# EasyEDA Pro project STM32控制板.eprj

# Schematic Schematic1
Create Date: 2023-07-01; Page Name: P1; Project Name: STM32控制板; Schematic Name: Schematic1; Update Date: 2023-07-01; Company: 嘉立创EDA; Page Size: A4; Version: V1.0
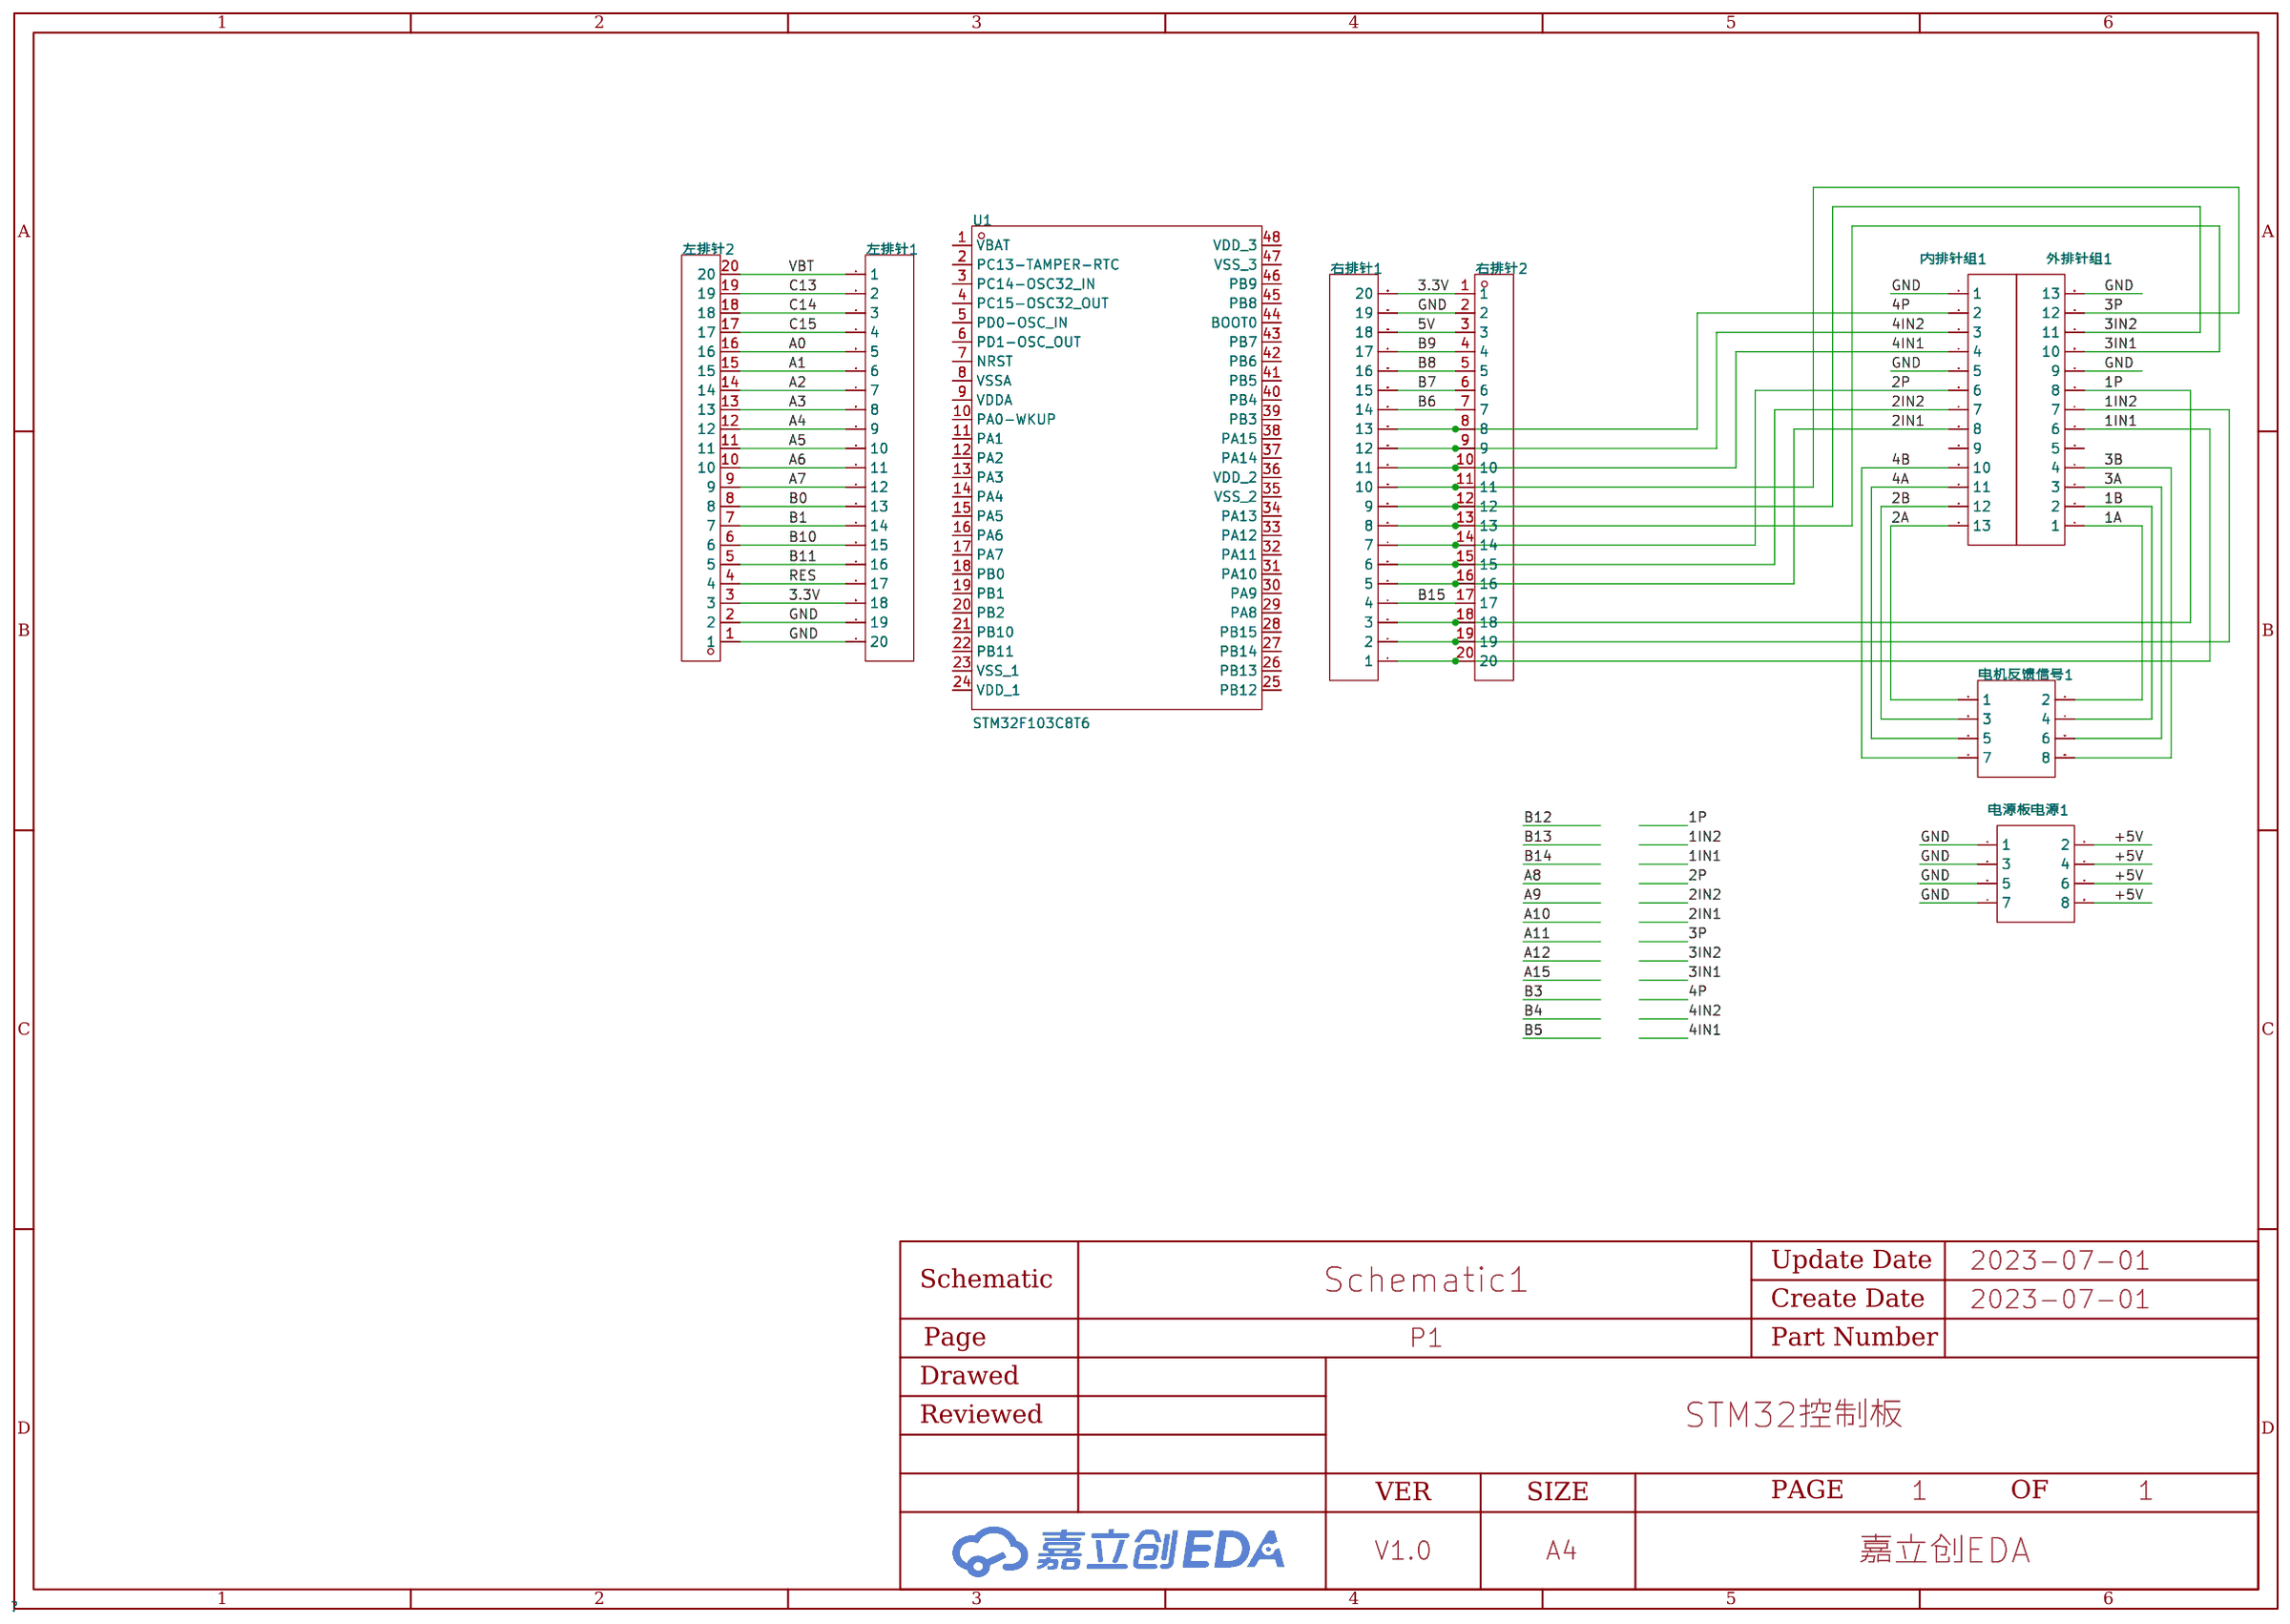
[diagram p0: schematic sheet]

## Parts
U1  STM32F103C8T6  [LQFP-48_L7.0-W7.0-P0.50-LS9.0-BL]
内排针组1  -  [HDR-TH_13P-P2.54-V-F]
右排针1  -  [HDR-TH_20P-P2.54-V-F]
右排针2  -  [HDR-TH_20P-P2.54-V-M-1]
外排针组1  -  [HDR-TH_13P-P2.54-V-F]
左排针1  -  [HDR-TH_20P-P2.54-V-F]
左排针2  -  [HDR-TH_20P-P2.54-V-M-1]
电机反馈信号1  -  [HDR-TH_8P-P2.54-V-F-R2-C4-S2.54-1]
电源板电源1  -  [HDR-TH_8P-P2.54-V-F-R2-C4-S2.54-1]

## Library data of the parts
U1 = STM32F103C8T6: CPU内核:ARM Cortex-M3;CPU最大主频:72MHz;程序存储容量:64KB;程序存储器类型:FLASH;RAM总容量:20KB;GPIO端口数量:37;; LCSC Part Name: ARM Cortex-M3 72MHz MSL=3; Supplier Part: C8734; Manufacturer: ST(意法半导体); Supplier Footprint: LQFP-48(7x7); JLCPCB Part Class: Basic Part; Datasheet: https://atta.szlcsc.com/upload/public/pdf/source/20220812/8363ACEC51AD55ECEB84799464F7CB85.pdf; Supplier: LCSC; CPU Core: ARM Cortex-M3; CPU Maximum Speed: 72MHz; Operating Voltage Range: 2V~3.6V; Program Storage Size: 64KB; Program Memory Type: FLASH; RAM Size: 20KB; GPIO Ports Number: 37; ADC (Bit): 12bit; Universal Serial Bus: 有; Peripheral/Function: 看门狗；DMA；看门狗；片载温度传感器; Watchdog: 有; Infrared Data Association: 有; Low-Voltage Detect: 有; Direct Memory Access: 有; Internal Oscillator: 有; Operating Temperature Range: -40℃~+85℃
内排针组1 外排针组1 = HDR-F_2.54_1x13P: Supplier Part: C52709; Supplier Footprint: 插件
右排针1 左排针1 = HDR-F_2.54_1x20P: Supplier Part: C50984; Supplier Footprint: 插件
右排针2 左排针2 = HDR-M_2.54_1x20P: 间距:2.54mm;总PIN位数:20;排数:1;插针结构:-;行距:-;安装类型:直插;圆针/方针:-;额定电流:-;额定电压:-;配合针长度:-;塑高:-;触头材质:黄铜;触头镀层:-;颜色:黑色;; Supplier Part: C50981; Supplier Footprint: 插件
电机反馈信号1 电源板电源1 = HDR-F_2.54_2x4: Supplier Part: C92271; Supplier Footprint: 插件

## Nets
3.3V: 右排针1.20 右排针2.1 左排针1.18 左排针2.3
5V: 右排针1.18 右排针2.3
+5V: 电源板电源1.2 电源板电源1.4 电源板电源1.6 电源板电源1.8
GND: 内排针组1.1 内排针组1.5 右排针1.19 右排针2.2 外排针组1.9 外排针组1.13 左排针1.19 左排针1.20 左排针2.1 左排针2.2 电源板电源1.1 电源板电源1.3 电源板电源1.5 电源板电源1.7
1A: 外排针组1.1 电机反馈信号1.2
1B: 外排针组1.2 电机反馈信号1.4
1IN1: 右排针1.1 右排针2.20 外排针组1.6
1IN2: 右排针1.2 右排针2.19 外排针组1.7
1P: 右排针1.3 右排针2.18 外排针组1.8
2A: 内排针组1.13 电机反馈信号1.1
2B: 内排针组1.12 电机反馈信号1.3
2IN1: 内排针组1.8 右排针1.5 右排针2.16
2IN2: 内排针组1.7 右排针1.6 右排针2.15
2P: 内排针组1.6 右排针1.7 右排针2.14
3A: 外排针组1.3 电机反馈信号1.6
3B: 外排针组1.4 电机反馈信号1.8
3IN1: 右排针1.8 右排针2.13 外排针组1.10
3IN2: 右排针1.9 右排针2.12 外排针组1.11
3P: 右排针1.10 右排针2.11 外排针组1.12
4A: 内排针组1.11 电机反馈信号1.5
4B: 内排针组1.10 电机反馈信号1.7
4IN1: 内排针组1.4 右排针1.11 右排针2.10
4IN2: 内排针组1.3 右排针1.12 右排针2.9
4P: 内排针组1.2 右排针1.13 右排针2.8
A0: 左排针1.5 左排针2.16
A1: 左排针1.6 左排针2.15
A2: 左排针1.7 左排针2.14
A3: 左排针1.8 左排针2.13
A4: 左排针1.9 左排针2.12
A5: 左排针1.10 左排针2.11
A6: 左排针1.11 左排针2.10
A7: 左排针1.12 左排针2.9
B0: 左排针1.13 左排针2.8
B1: 左排针1.14 左排针2.7
B6: 右排针1.14 右排针2.7
B7: 右排针1.15 右排针2.6
B8: 右排针1.16 右排针2.5
B9: 右排针1.17 右排针2.4
B10: 左排针1.15 左排针2.6
B11: 左排针1.16 左排针2.5
B15: 右排针1.4 右排针2.17
C13: 左排针1.2 左排针2.19
C14: 左排针1.3 左排针2.18
C15: 左排针1.4 左排针2.17
RES: 左排针1.17 左排针2.4
VBT: 左排针1.1 左排针2.20

Not connected (* = marked no-connect by the designer): U1 1(VBAT) 2(PC13-TAMPER-RTC) 3(PC14-OSC32_IN) 4(PC15-OSC32_OUT) 5(PD0-OSC_IN) 6(PD1-OSC_OUT) 7(NRST) 8(VSSA) 9(VDDA) 10(PA0-WKUP) 11(PA1) 12(PA2) 13(PA3) 14(PA4) 15(PA5) 16(PA6) 17(PA7) 18(PB0) 19(PB1) 20(PB2) 21(PB10) 22(PB11) 23(VSS_1) 24(VDD_1) 25(PB12) 26(PB13) 27(PB14) 28(PB15) 29(PA8) 30(PA9) 31(PA10) 32(PA11) 33(PA12) 34(PA13) 35(VSS_2) 36(VDD_2) 37(PA14) 38(PA15) 39(PB3) 40(PB4) 41(PB5) 42(PB6) 43(PB7) 44(BOOT0) 45(PB8) 46(PB9) 47(VSS_3) 48(VDD_3); 内排针组1 9; 外排针组1 5

# Board PCB1
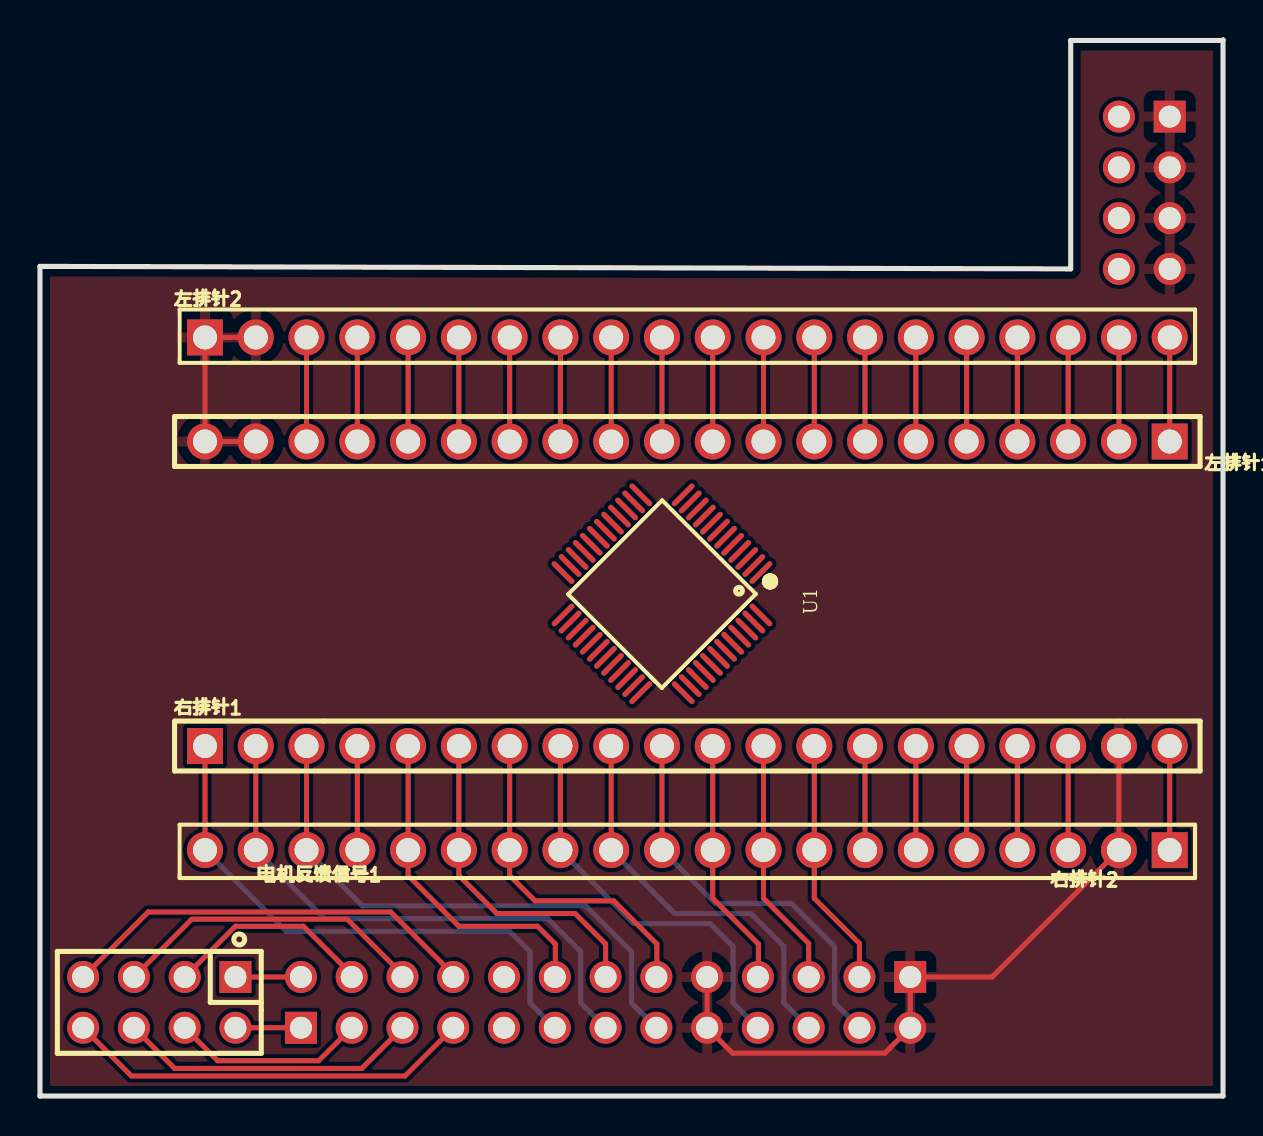
[diagram p1: board, top side]
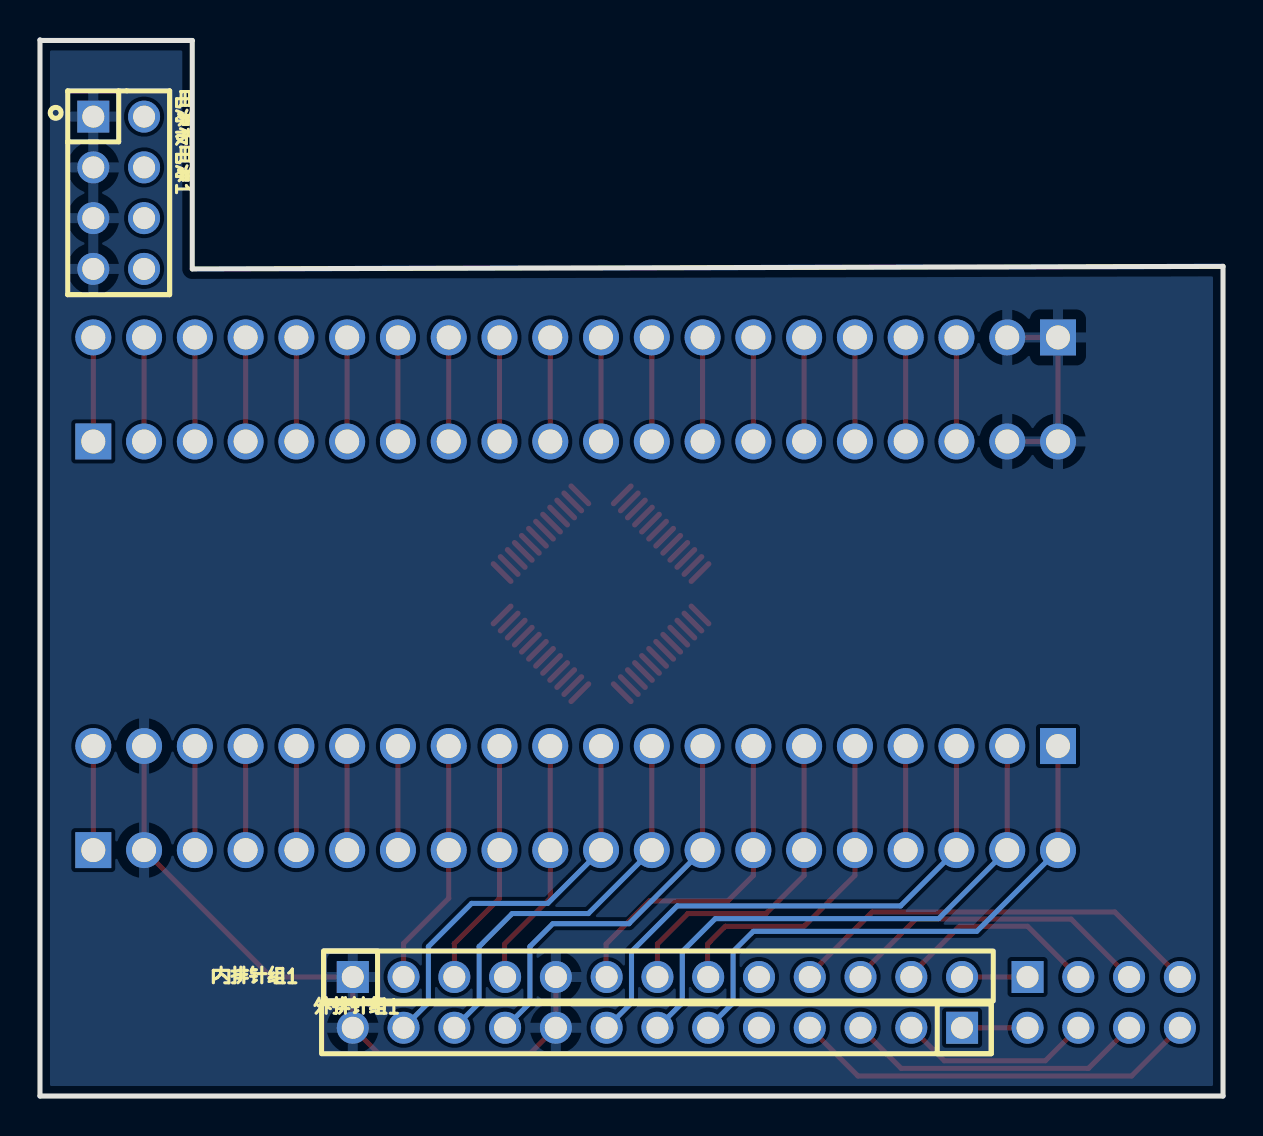
[diagram p2: board, bottom side, seen from below]

Outline 59.18 x 52.84 mm; copper layers: Top Layer, Bottom Layer. Coordinates in mm from the lower left corner of the outline.
Outline path: 0,41.52 51.56,41.39 51.56,52.82 59.16,52.82 59.18,52.84 59.18,0 0,0 0,41.52
Stack: Top Layer 0.035mm / Dielectric1 1.51mm FR4 er 4.5 / Bottom Layer 0.035mm

## Design rules (mm)
template: JLCPCB Capability(Two Layers Board)
spacing copperThickness1oz (default): track to track 0.102, other pairs 0.152 to 0.3
spacing copperThickness2oz: track to track 0.203, other pairs 0.152 to 0.3
track width copperThickness1oz (default): min 0.127, default 0.254, max 2.54
track width copperThickness2oz: min 0.203, default 0.254, max 2.54
differential pair differentialPair (default): width min 0.127, default 0.254, max 2.54; gap min 0.152, default 0.152
via viaSize (default): diameter min 0.5, default 0.61, max 10; hole min 0.3, default 0.305, max 6.3

## Placement (name value [footprint] x y rotation side)
U1  STM32F103C8T6  [LQFP-48_L7.0-W7.0-P0.50-LS9.0-BL]  31.12 25.13 135 top
内排针组1  -  [HDR-TH_13P-P2.54-V-F]  28.29 5.96 180 bottom
右排针1  -  [HDR-TH_20P-P2.54-V-F]  32.38 17.51 0 top
右排针2  -  [HDR-TH_20P-P2.54-V-M-1]  32.38 12.31 180 top
外排针组1  -  [HDR-TH_13P-P2.54-V-F]  28.29 3.42 0 bottom
左排针1  -  [HDR-TH_20P-P2.54-V-F]  32.38 32.75 180 top
左排针2  -  [HDR-TH_20P-P2.54-V-M-1]  32.38 37.96 0 top
电机反馈信号1  -  [HDR-TH_8P-P2.54-V-F-R2-C4-S2.54-1]  5.97 4.69 180 top
电源板电源1  -  [HDR-TH_8P-P2.54-V-F-R2-C4-S2.54-1]  55.25 45.2 270 bottom

## Footprints (pads in the part's own frame, mm; a bottom-side part is the same pattern mirrored in y, then rotated)
HDR-TH_8P-P2.54-V-F-R2-C4-S2.54-1
  rect 1.6x1.6 hole 1.1: 1(-3.81,-1.27)
  round 1.6 hole 1.1: 2(-3.81,1.27) 3(-1.27,-1.27) 4(-1.27,1.27) 5(1.27,-1.27) 6(1.27,1.27) 7(3.81,-1.27) 8(3.81,1.27)
HDR-TH_13P-P2.54-V-F
  rect 1.6x1.6 hole 1.1: 1(-15.24,0)
  round 1.6 hole 1.1: 2(-12.7,0) 3(-10.16,0) 4(-7.62,0) 5(-5.08,0) 6(-2.54,0) 7(0,0) 8(2.54,0) 9(5.08,0) 10(7.62,0) 11(10.16,0) 12(12.7,0) 13(15.24,0)
HDR-TH_20P-P2.54-V-F
  rect 1.8x1.8 hole 1.2: 1(-24.13,0)
  round 1.8 hole 1.2: 2(-21.59,0) 3(-19.05,0) 4(-16.51,0) 5(-13.97,0) 6(-11.43,0) 7(-8.89,0) 8(-6.35,0) 9(-3.81,0) 10(-1.27,0) 11(1.27,0) 12(3.81,0) 13(6.35,0) 14(8.89,0) 15(11.43,0) 16(13.97,0) 17(16.51,0) 18(19.05,0) 19(21.59,0) 20(24.13,0)
HDR-TH_20P-P2.54-V-M-1
  rect 1.8x1.8 hole 1.2: 1(-24.13,0)
  round 1.8 hole 1.2: 2(-21.59,0) 3(-19.05,0) 4(-16.51,0) 5(-13.97,0) 6(-11.43,0) 7(-8.89,0) 8(-6.35,0) 9(-3.81,0) 10(-1.27,0) 11(1.27,0) 12(3.81,0) 13(6.35,0) 14(8.89,0) 15(11.43,0) 16(13.97,0) 17(16.51,0) 18(19.05,0) 19(21.59,0) 20(24.13,0)
LQFP-48_L7.0-W7.0-P0.50-LS9.0-BL
  oval 0.27x1.5 smd: 1(-2.75,-4.25) 2(-2.25,-4.25) 3(-1.75,-4.25) 4(-1.25,-4.25) 5(-0.75,-4.25) 6(-0.25,-4.25) 7(0.25,-4.25) 8(0.75,-4.25) 9(1.25,-4.25) 10(1.75,-4.25) 11(2.25,-4.25) 12(2.75,-4.25) 25(2.75,4.25) 26(2.25,4.25) 27(1.75,4.25) 28(1.25,4.25) 29(0.75,4.25) 30(0.25,4.25) 31(-0.25,4.25) 32(-0.75,4.25) 33(-1.25,4.25) 34(-1.75,4.25) 35(-2.25,4.25) 36(-2.75,4.25)
  oval 1.5x0.27 smd: 13(4.25,-2.75) 14(4.25,-2.25) 15(4.25,-1.75) 16(4.25,-1.25) 17(4.25,-0.75) 18(4.25,-0.25) 19(4.25,0.25) 20(4.25,0.75) 21(4.25,1.25) 22(4.25,1.75) 23(4.25,2.25) 24(4.25,2.75) 37(-4.25,2.75) 38(-4.25,2.25) 39(-4.25,1.75) 40(-4.25,1.25) 41(-4.25,0.75) 42(-4.25,0.25) 43(-4.25,-0.25) 44(-4.25,-0.75) 45(-4.25,-1.25) 46(-4.25,-1.75) 47(-4.25,-2.25) 48(-4.25,-2.75)

## Nets
As in the schematic.

Pads without a net: U1 1 2 3 4 5 6 7 8 9 10 11 12 13 14 15 16 17 18 19 20 21 22 23 24 25 26 27 28 29 30 31 32 33 34 35 36 37 38 39 40 41 42 43 44 45 46 47 48; 内排针组1 9; 外排针组1 5

## Routing (per net, layer and track width the routed paths; a pad name or vN(x,y) marks a point on that pad's centre or on a via; arc(x,y) is an arc through that point)
3.3V: length 10.4
  Top Layer w0.254: 左排针2.3 左排针1.18 ; 右排针2.1 右排针1.20
5V: length 5.2
  Top Layer w0.254: 右排针2.3 右排针1.18
GND: length 44.9
  Top Layer w0.254: 右排针1.19 右排针2.2 47.62,5.96 内排针组1.1 外排针组1.13 42.26,2.15 34.64,2.15 外排针组1.9 内排针组1.5 ; 左排针2.2 左排针2.1 左排针1.20 左排针1.19
1A: length 3.3
  Top Layer w0.254: 外排针组1.1 电机反馈信号1.2
1B: length 9.7
  Top Layer w0.254: 外排针组1.2 13.94,1.76 8.89,1.76 电机反馈信号1.4
1IN1: length 27.9
  Top Layer w0.254: 右排针2.20 右排针1.1
  Bottom Layer w0.254: 外排针组1.6 24.51,4.66 24.51,7.23 23.5,8.24 12.32,8.24 右排针2.20
1IN2: length 27.9
  Top Layer w0.254: 右排针2.19 右排针1.2
  Bottom Layer w0.254: 外排针组1.7 27.05,4.66 27.05,7.23 25.4,8.88 14.22,8.88 右排针2.19
1P: length 27.9
  Top Layer w0.254: 右排针2.18 右排针1.3
  Bottom Layer w0.254: 右排针2.18 16.13,9.51 27.31,9.51 29.59,7.23 29.59,4.66 外排针组1.8
2A: length 3.4
  Top Layer w0.254: 13.18,5.96 电机反馈信号1.1
2B: length 10.6
  Top Layer w0.254: 15.72,5.96 13.18,8.5 9.78,8.5 电机反馈信号1.3
2IN1: length 16.9
  Top Layer w0.254: 右排针1.5 右排针2.16 18.41,11.04 20.96,8.5 24.89,8.5 25.78,7.61 25.78,5.96
2IN2: length 16.9
  Top Layer w0.254: 右排针1.6 右排针2.15 20.96,11.04 22.86,9.13 26.77,9.13 28.29,7.61 内排针组1.7
2P: length 16.9
  Top Layer w0.254: 30.86,5.96 30.86,7.61 28.7,9.77 24.77,9.77 23.5,11.04 右排针2.14 右排针1.7
3A: length 15.1
  Top Layer w0.254: 电机反馈信号1.6 6.73,1.38 16.1,1.38 外排针组1.3
3B: length 20.5
  Top Layer w0.254: 电机反馈信号1.8 4.57,1 18.26,1 外排针组1.4
3IN1: length 20.4
  Top Layer w0.254: 右排针2.13 右排针1.8
  Bottom Layer w0.254: 外排针组1.10 34.67,4.66 34.67,7.48 33.53,8.62 29.72,8.62 右排针2.13
3IN2: length 20.4
  Top Layer w0.254: 右排针2.12 右排针1.9
  Bottom Layer w0.254: 外排针组1.11 37.21,4.66 37.21,7.48 35.56,9.13 31.75,9.13 右排针2.12
3P: length 20.4
  Top Layer w0.254: 右排针2.11 右排针1.10
  Bottom Layer w0.254: 外排针组1.12 39.75,4.66 39.75,7.48 37.59,9.64 33.78,9.64 右排针2.11
4A: length 16
  Top Layer w0.254: 18.26,5.96 15.37,8.85 7.59,8.85 电机反馈信号1.5
4B: length 21.3
  Top Layer w0.254: 20.8,5.96 17.55,9.21 5.41,9.21 电机反馈信号1.7
4IN1: length 12.5
  Top Layer w0.254: 右排针1.11 右排针2.10 33.66,9.89 35.94,7.61 35.94,5.96
4IN2: length 12.5
  Top Layer w0.254: 内排针组1.3 38.45,7.63 36.19,9.89 右排针2.9 右排针1.12
4P: length 12.5
  Top Layer w0.254: 右排针1.13 右排针2.8 38.74,9.89 40.99,7.63 内排针组1.2
A0: length 5.2
  Top Layer w0.254: 左排针2.16 左排针1.5
A1: length 5.2
  Top Layer w0.254: 左排针2.15 左排针1.6
A2: length 5.2
  Top Layer w0.254: 左排针2.14 左排针1.7
A3: length 5.2
  Top Layer w0.254: 左排针2.13 左排针1.8
A4: length 5.2
  Top Layer w0.254: 左排针2.12 左排针1.9
A5: length 5.2
  Top Layer w0.254: 左排针2.11 左排针1.10
A6: length 5.2
  Top Layer w0.254: 左排针2.10 左排针1.11
A7: length 5.2
  Top Layer w0.254: 左排针2.9 左排针1.12
B0: length 5.2
  Top Layer w0.254: 左排针2.8 左排针1.13
B1: length 5.2
  Top Layer w0.254: 左排针2.7 左排针1.14
B6: length 5.2
  Top Layer w0.254: 右排针2.7 右排针1.14
B7: length 5.2
  Top Layer w0.254: 右排针2.6 右排针1.15
B8: length 5.2
  Top Layer w0.254: 右排针2.5 右排针1.16
B9: length 5.2
  Top Layer w0.254: 右排针2.4 右排针1.17
B10: length 5.2
  Top Layer w0.254: 左排针2.6 左排针1.15
B11: length 5.2
  Top Layer w0.254: 左排针2.5 左排针1.16
B15: length 5.2
  Top Layer w0.254: 右排针1.4 右排针2.17
C13: length 5.2
  Top Layer w0.254: 左排针2.19 左排针1.2
C14: length 5.2
  Top Layer w0.254: 左排针2.18 左排针1.3
C15: length 5.2
  Top Layer w0.254: 左排针2.17 左排针1.4
RES: length 5.2
  Top Layer w0.254: 左排针2.4 左排针1.17
VBT: length 5.2
  Top Layer w0.254: 左排针2.20 左排针1.1

## Copper pours and planes (outline as drawn; the poured copper is in the pictures)
GND on Top Layer: -7.75,54.85 60.83,54.85 60.83,-2.81 -7.75,-2.81
GND on Bottom Layer: -6.86,58.41 64.64,58.41 64.64,-1.16 -6.86,-1.16
